# Altium project WiWi_SDR.PrjPcb (part 2 of 2)

## Sheet 14-100M_Ethernet.SchDoc
size B; SheetNumber: 14; SheetTotal: 16
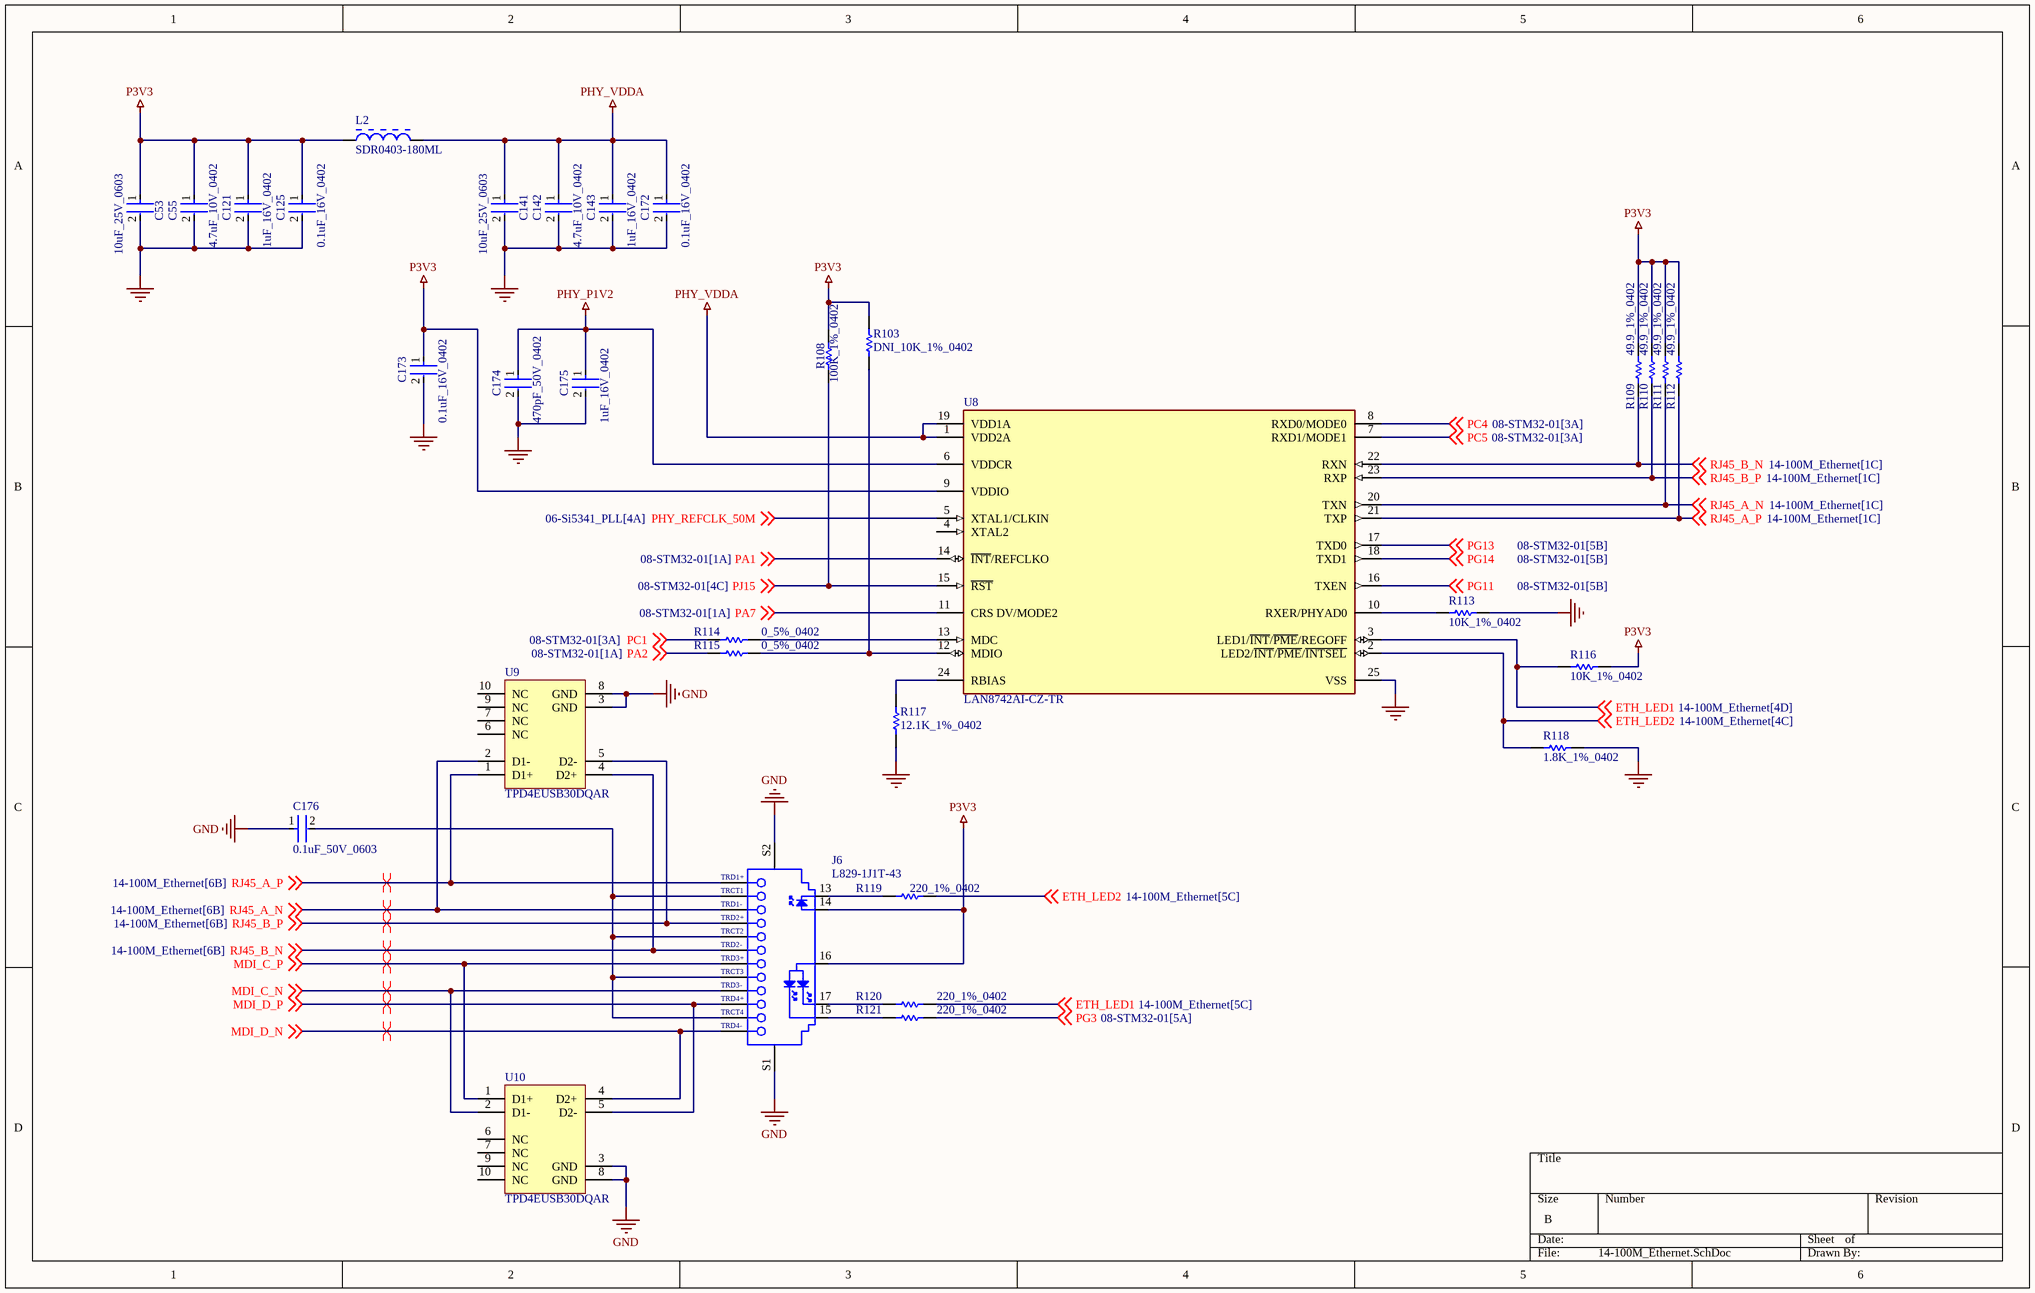
[diagram p4: 14-100M_Ethernet.SchDoc]

### Parts
C53  10uF_25V_0603  [FP-CL10-IPC_C]
C55  4.7uF_10V_0402  [FP-C1005-050-0_15-MFG]
C121  1uF_16V_0402  [FP-0402-L_1_0_0_05-W_0_5-IPC_A]
C125  0.1uF_16V_0402  [FP-C0402-BB-MFG]
C141  10uF_25V_0603  [FP-CL10-IPC_C]
C142  4.7uF_10V_0402  [FP-C1005-050-0_15-MFG]
C143  1uF_16V_0402  [FP-0402-L_1_0_0_05-W_0_5-IPC_A]
C172  0.1uF_16V_0402  [FP-C0402-BB-MFG]
C173  0.1uF_16V_0402  [FP-C0402-BB-MFG]
C174  470pF_50V_0402  [FP-GRM155-0_05-IPC_A]
C175  1uF_16V_0402  [FP-0402-L_1_0_0_05-W_0_5-IPC_A]
C176  0.1uF_50V_0603  [FP-C0603-CJ-MFG]
J6  L829-1J1T-43  [BELS-L829-1J1T-43_V]
L2  SDR0403-180ML  [BOUR-SDR0403-2_V]
R103  DNI_10K_1%_0402  [RESC1005X40X25NL10T10]  (no BOM)
R108  100K_1%_0402  [RESC1005X40X25ML05T10]
R109  49.9_1%_0402  [RESC1005X40X25NL10T10]
R110  49.9_1%_0402  [RESC1005X40X25NL10T10]
R111  49.9_1%_0402  [RESC1005X40X25NL10T10]
R112  49.9_1%_0402  [RESC1005X40X25NL10T10]
R113  10K_1%_0402  [RESC1005X40X25NL10T10]
R114  0_5%_0402  [RESC1005X40X25NL05T10]
R115  0_5%_0402  [RESC1005X40X25NL05T10]
R116  10K_1%_0402  [RESC1005X40X25NL10T10]
R117  12.1K_1%_0402  [RESC1005X40X25ML05T10]
R118  1.8K_1%_0402  [RESC1005X40X25LL05T05]
R119  220_1%_0402  [RESC1005X40X25LL10T10]
R120  220_1%_0402  [RESC1005X40X25LL10T10]
R121  220_1%_0402  [RESC1005X40X25LL10T10]
U8  LAN8742AI-CZ-TR  [FP-C04-143-MFG]
U9  TPD4EUSB30DQAR  [DQA0010A_V]
U10  TPD4EUSB30DQAR  [DQA0010A_V]

### Nets
GND: C53.2 C55.2 C121.2 C125.2 C141.2 C142.2 C143.2 C172.2 C173.2 C174.2 C175.2 C176.1 J6.S1 J6.S2 R113.1 R117.1 R118.2 U8.25(VSS) U9.3(GND) U9.8(GND) U10.3(GND) U10.8(GND)
P3V3: C53.1 C55.1 C121.1 C125.1 C173.1 J6.14 J6.16 L2.1 R103.1 R108.2 R109.1 R110.1 R111.1 R112.1 R116.1 U8.9(VDDIO)
PHY_P1V2: C174.1 C175.1 U8.6(VDDCR)
PHY_VDDA: C141.1 C142.1 C143.1 C172.1 L2.2 U8.1(VDD2A) U8.19(VDD1A)
ETH_LED1: R116.2 R120.2 U8.3(LED1/~{INT}/~{PME}/REGOFF) ; off-sheet ETH_LED1
ETH_LED2: R118.1 R119.2 U8.2(LED2/~{INT}/~{PME}/~{INTSEL}) ; off-sheet ETH_LED2
MDI_C_N: J6.9(TRD3-) U10.2(D1-) ; off-sheet MDI_C_N
MDI_C_P: J6.7(TRD3+) U10.1(D1+) ; off-sheet MDI_C_P
MDI_D_N: J6.12(TRD4-) U10.4(D2+) ; off-sheet MDI_D_N
MDI_D_P: J6.10(TRD4+) U10.5(D2-) ; off-sheet MDI_D_P
PA1: U8.14(~{INT}/REFCLKO) ; off-sheet PA1
PA2: R115.1 ; off-sheet PA2
PA7: U8.11(CRS_DV/MODE2) ; off-sheet PA7
PC1: R114.1 ; off-sheet PC1
PC4: U8.8(RXD0/MODE0) ; off-sheet PC4
PC5: U8.7(RXD1/MODE1) ; off-sheet PC5
PG3: R121.2 ; off-sheet PG3
PG11: U8.16(TXEN) ; off-sheet PG11
PG13: U8.17(TXD0) ; off-sheet PG13
PG14: U8.18(TXD1) ; off-sheet PG14
PHY_REFCLK_50M: U8.5(XTAL1/CLKIN) ; off-sheet PHY_REFCLK_50M
PJ15: R108.1 U8.15(~{RST}) ; off-sheet PJ15
RJ45_A_N: J6.3(TRD1-) R111.2 U8.20(TXN) U9.2(D1-) ; off-sheet RJ45_A_N
RJ45_A_P: J6.1(TRD1+) R112.2 U8.21(TXP) U9.1(D1+) ; off-sheet RJ45_A_P
RJ45_B_N: J6.6(TRD2-) R109.2 U8.22(RXN) U9.4(D2+) ; off-sheet RJ45_B_N
RJ45_B_P: J6.4(TRD2+) R110.2 U8.23(RXP) U9.5(D2-) ; off-sheet RJ45_B_P
NetC176_2: C176.2 J6.2(TRCT1) J6.5(TRCT2) J6.8(TRCT3) J6.11(TRCT4)
NetJ6_13: J6.13 R119.1
NetJ6_15: J6.15 R121.1
NetJ6_17: J6.17 R120.1
NetR103_2: R103.2 R115.2 U8.12(MDIO)
NetR113_2: R113.2 U8.10(RXER/PHYAD0)
NetR114_2: R114.2 U8.13(MDC)
NetR117_2: R117.2 U8.24(RBIAS)

Not connected (* = marked no-connect by the designer): U8 4(XTAL2); U9 6(NC) 7(NC) 9(NC) 10(NC); U10 6(NC) 7(NC) 9(NC) 10(NC)

### Layout directives
differential pair: MDI_C_N, MDI_C_P, MDI_D_N, MDI_D_P, RJ45_A_N, RJ45_A_P, RJ45_B_N, RJ45_B_P

### Library data of the parts
C53 C141 = CMP-13271-004224-1: Cap Ceramic 10uF 25V X5R ±20% Pad SMD 0603 +85°C T/R; Width: 0.031inch; Voltage Rating: 25V; Length: 0.063inch; Case Code (Metric): 1608; Dielectric: X5R; Termination: Wraparound; Capacitance: 10uF; Lead Free: Lead Free; Mount: Surface Mount; Package Quantity: 1; Case Code (Imperial): 0603; Thickness: 0.035inch; Packaging: Tape and Reel; Contact Plating: Tin; Min Operating Temperature: -55°C; Tolerance: 20%; Max Operating Temperature: 85°C; Case/Package: 0603
C55 C142 = CMP-2000-05997-2: CAP CER 4.7UF 10V X5R 0402; Dielectric Material: Ceramic; Tolerance: 10%; Series: C; Package Quantity: 10000; Max Operating Temperature: 85°C; Case Code (Imperial): 0402; Lead Free: Lead Free; Voltage Rating (DC): 10V; Packaging: Cut Tape; Voltage Rating: 10V; Min Operating Temperature: -55°C; Dielectric: X5R; Thickness: 0.022inch; Width: 0.02inch; Case/Package: 0402; Case Code (Metric): 1005; Capacitance: 4.7uF; Length: 0.039inch; RoHS Compliant: Yes; REACH SVHC: No SVHC; Mount: Surface Mount
C121 C143 C175 = CMP-14477-000104-2: None; Tolerance: 10%; Voltage Rating: 16V; Dielectric: X5R; Capacitance: 1uF; Packaging: Tape and Reel; Depth: 0.5mm; Mount: Surface Mount; Thickness: 0.022inch; Package Quantity: 1; Min Operating Temperature: -55°C; Series: M; Voltage Rating (DC): 16V; Termination: SMD/SMT; Case/Package: 0402; Number of Pins: 2; Case Code (Imperial): 0402; Length: 1mm; Halogen Free: Halogen Free; Case Code (Metric): 1005; Width: 0.02inch; RoHS Compliant: Yes; Radiation Hardening: No; Max Operating Temperature: 85°C; Height: 0.5mm; Construction: Flat
C125 C172 C173 = CMP-1034-02068-3: CAP CER 0.1UF 16V 5% X7R 0402; Manufacturer: Kemet; Manufacturer Part Number: C0402C104J4RACTU; Value: 0.10 μF; Temperature Coefficient: 15%; Tolerance: 0.05; Material: Ceramic; ComponentLink2URL: https://content.kemet.com/datasheets/KEM_C1002_X7R_SMD.pdf; Automotive: No; Device Class L2: Capacitors; Temperature: -55°C to +125°C; RoHS: TRUE; Voltage Rating: 16 V; ComponentLink2Description: Datasheet; Device Class L3: Ceramic Capacitors; Temperature Range Low: -55°C; Ipc Land Pattern Name: CAPC10050X50; Device Class L1: Passive Components; Temperature Range High: +125°C; Package: C0402-BB; Capacitance: 0.10 μF; Category: Cap; Mouser Description: CAP CER 0.1UF 16V X7R 0402; Height: 0.55mm; Digikey Description: CAP CER 0.1UF 16V 5% X7R 0402; Octopart: https://octopart.com/c0402c104j4ractu-kemet-12573893; Temperature Characteristic: X7R; Lead Free: Yes
C174 = CMP-2008-04369-2: Chip Multilayer Ceramic Capacitors for General Purpose, 0402, 470pF, C0G, 30ppm/°C, 5%, 50V; Insulation Resistance: 10GR; Depth: 0.5mm; Voltage Rating: 50V; Packaging: Tape and Reel; Material: Ceramic; Lead Free: Lead Free; Max Operating Temperature: 125°C; Length: 1mm; Min Operating Temperature: -55°C; Height: 0.5mm; Width: 0.5mm; Thickness: 0.022inch; Voltage: 50V; Termination: SMD/SMT; Dielectric Material: Ceramic; REACH SVHC: No SVHC; Voltage Rating (DC): 50V; Package Quantity: 1; Dielectric: C0G; Radiation Hardening: No; Mount: Surface Mount; Case/Package: 0402; Number of Pins: 2; Tolerance: 5%; Temperature Coefficient: 30ppm/°C; Case Code (Metric): 1005; Capacitance: 470pF; Case Code (Imperial): 0402
C176 = CMP-2006-03300-2: CAP CER 0.1UF 50V X7R 0603; Manufacturer Part Number: C0603X104K5RACTU; Manufacturer: Kemet; Capacitance: 100nF; Material: Ceramic; Tolerance: 10%; Value: 100nF; Temperature Coefficient: 15%; Temperature Range High: +125°C; Temperature Range Low: -55°C; Voltage: 50V; ComponentLink2Description: Datasheet; RoHS: TRUE; ComponentLink2URL: https://content.kemet.com/datasheets/KEM_C1013_X7R_FT-CAP_SMD.pdf; Device Class L3: Ceramic Capacitors; Device Class L2: Capacitors; Package: C0603-CJ; Height: 0.95mm; Device Class L1: Passive Components; Temperature Characteristic: X7R; Lead Free: Yes; Digikey Description: CAP CER 0.1UF 50V X7R 0603; Automotive: No; Mouser Description: Capacitor; Ceramic; Cap 0.1uF; Tol+10%; SMT; Flexible Termination; Vol-Rtg 50V; TR; Temperature: -55°C to +125°C; Octopart: https://octopart.com/c0603x104k5ractu-kemet-9145062; Category: Cap; Voltage Rating: 50V; Ipc Land Pattern Name: CAPC16080X80
J6 = CMP-1715-00001-1: Gigabit MagJack(R) Ultra Low Profile, 10/100/1000 Base-T, 19-Pin THD, RoHS, Tray; Width: 24.13 mm; RoHSCompliant: True; PartNumber: L829-1J1T-43; Case/Package: Metal; Mount: Through Hole; ComponentLink1Description: Manufacturer URL; Height: 11.3 mm; Package Quantity: 60; Packaging: Tray; Length: 17.78 mm; PackageDescription: 19-Pin Through Hole Device, Body 23.94 x 17.58 mm, Pitch 2.03 mm; ComponentLink2URL: http://belfuse.com/pdfs/L829-1J1T-43.pdf; ComponentLink1URL: http://belfuse.com/ethernet/; Mounting Technology: Through Hole; DatasheetVersion: Rev. G; Pins: 8; ComponentLink2Description: Datasheet
L2 = CMP-0904-00005-1: SDR0403 Series Power Inductor, 18 uF +/- 20 %, 0.34 Ohm, -40 to 125 degC, 2-Pin SMD, RoHS, Tape and Reel; Manufacturer: Bourns; Tolerance (%): +/- 20; I rms (A): 0.84 Max.; Q: 25; I sat (A): 1.3 Typ.; Test Frequency (MHz): 2.52; Inductance (uH): 18; SRF (MHz): 23 Min.; RDC (Ohm): 0.34 Max.; PackageReference: SDR0403-2; ComponentLink1URL: http://www.bourns.com/; RoHS: TRUE; PartNumber: SDR0403-180ML; ComponentLink2Description: Datasheet; Packing: Tape and Reel; Temperature Range: -40 to 125 degC; Mounting Technology: Surface Mount; DatasheetVersion: Feb-12; PackageDescription: 3-Pin SMD, Dia 4.5 mm, Height 3.5 mm; ComponentLink2URL: http://www.bourns.com/data/global/pdfs/sdr0403.pdf; ComponentLink1Description: Manufacturer URL
R103 R113 R116 = CMP-2002-04694-1: Manufacturer: Bourns; Part Number: CR0402-FX-1002GLF
R108 = CMP-2002-07852-1: Manufacturer: Yageo; Part Number: RC0402FR-13100KL
R109-R112 = CMP-2002-04448-1: Part Number: RK73H1ETTP49R9F; Manufacturer: KOA Speer
R114 R115 = CMP-2002-06457-1: Manufacturer: Panasonic; Part Number: ERJ-U020R00X
R117 = CMP-2002-07375-1: Part Number: RC0402FR-0712K1L; Manufacturer: Yageo / Phycomp
R118 = CMP-2002-01128-1: Manufacturer: Panasonic; Part Number: ERJ2RKF1801X
R119-R121 = CMP-2002-03891-1: Part Number: RK73H1ETTP2200F; Manufacturer: KOA Speer
U8 = CMP-06281-000002-1: IC TRANSCEIVER FULL 1/1 24SQFN; Manufacturer: Microchip; Simplex Duplex: Full Duplex; Max Supply Voltage: 3.6V; Standoff Height: 0mm; Number Of Channels: 1; Data Rate: 100Mbits/s; Interface: Ethernet,Other; Min Supply Voltage: 1.14V; Ambient Temperature Range Low: -40°C; Height: 1mm; Digikey Description: IC TRANSCEIVER FULL 1/1 24SQFN; Lead Free: Yes; Category: IC; Temperature Range Low: -40°C; Temperature: -40°C to +85°C; RoHS: TRUE; ComponentLink2URL: http://ww1.microchip.com/downloads/en/DeviceDoc/DS_LAN8742_00001989A.pdf; Package: C04-143; Mouser Description: Small Footprint RMII 10/100 Ethernet Transceiver with flexPWR Technology; Device Class L1: Integrated Circuits (ICs); Temperature Range High: +85°C; Device Class L2: Interface ICs; ComponentLink2Description: Datasheet; Manufacturer Part Number: LAN8742AI-CZ-TR; Device Class L3: Ethernet Interface ICs; Ambient Temperature Range High: +85°C; Ipc Land Pattern Name: QFN50P400X400X90-24; Octopart: https://octopart.com/lan8742ai-cz-tr-microchip-29030589; Automotive: No
U9 U10 = CMP-0326-00027-3: ESD Solution for Super-Speed (6 GBPS) USB 3.0 Interface, 4 Channels, -40 to +85 degC, 10-pin SON (DQA), Green (RoHS & no Sb/Br); Manufacturer: Texas Instruments; Differential Capacitance(pF): 0.05; Serial ATA / eSATA: TRUE; IO Capacitance(Typ)(pF): 0.8; IO Leakage Current(nA): 10; IEC 61000-4-2 Air-Gap(+/- kV): 8; ComponentLink3Description: URL Link1; PartNumber: TPD4EUSB30DQAR; DatasheetVersion: SLVSAC2C; ComponentLink2URL: http://www.ti.com/general/docs/lit/getliterature.tsp?genericPartNumber=TPD4EUSB30&fileType=pdf; USB Super Speed: TRUE; Eco-Plan: Green (RoHS & no Sb/Br); Mounting Technology: Surface Mount; 1394 / Firewire: TRUE; PackageVersion: revB, Sep-2009; SubFamily: ESD Solution; USB Full Speed: TRUE; USB High Speed: TRUE; ComponentLink2Description: Datasheet; ComponentLink1URL: http://www.ti.com/; IEC 61000-4-2 Contact(+/- kV): 8; Breakdown Voltage(Min)(V): 8; PackageReference: DQA0010A; ComponentLink1Description: Manufacturer URL; PackageDescription: 10-Pin Plastic Small Outline No-Lead, 1 x 2.5 x 0.55 mm Body, 0.5 mm Pitch; ComponentLink3URL: SamplesURL:http://www.ti.com/product/tpd4eusb30#samples; HDMI: TRUE

## Sheet 15-SDRAM_Flash.SchDoc
size B; SheetNumber: 15; SheetTotal: 16
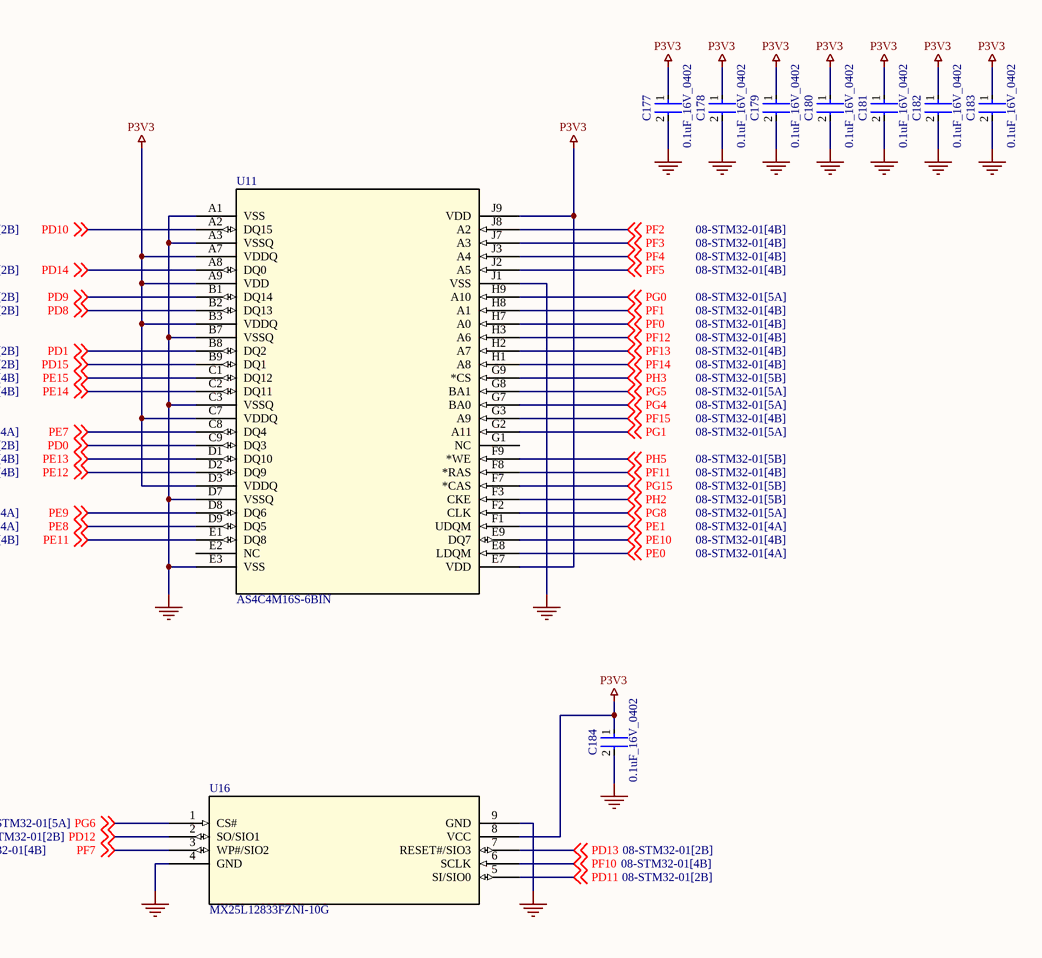
[diagram p5: 15-SDRAM_Flash.SchDoc]

### Parts
C177  0.1uF_16V_0402  [FP-C0402-BB-MFG]
C178  0.1uF_16V_0402  [FP-C0402-BB-MFG]
C179  0.1uF_16V_0402  [FP-C0402-BB-MFG]
C180  0.1uF_16V_0402  [FP-C0402-BB-MFG]
C181  0.1uF_16V_0402  [FP-C0402-BB-MFG]
C182  0.1uF_16V_0402  [FP-C0402-BB-MFG]
C183  0.1uF_16V_0402  [FP-C0402-BB-MFG]
C184  0.1uF_16V_0402  [FP-C0402-BB-MFG]
U11  AS4C4M16S-6BIN  [TFBGA-54_8X8_ALL]
U16  MX25L12833FZNI-10G  [WSON8_6X5X0p8_MAC]

### Nets
GND: C177.2 C178.2 C179.2 C180.2 C181.2 C182.2 C183.2 C184.2 U11.A1(VSS) U11.A3(VSSQ) U11.B7(VSSQ) U11.C3(VSSQ) U11.D7(VSSQ) U11.E3(VSS) U11.J1(VSS) U16.4(GND) U16.9(GND)
P3V3: C177.1 C178.1 C179.1 C180.1 C181.1 C182.1 C183.1 C184.1 U11.A7(VDDQ) U11.A9(VDD) U11.B3(VDDQ) U11.C7(VDDQ) U11.D3(VDDQ) U11.E7(VDD) U11.J9(VDD) U16.8(VCC)
PD0: U11.C9(DQ3) ; off-sheet PD0
PD1: U11.B8(DQ2) ; off-sheet PD1
PD8: U11.B2(DQ13) ; off-sheet PD8
PD9: U11.B1(DQ14) ; off-sheet PD9
PD10: U11.A2(DQ15) ; off-sheet PD10
PD11: U16.5(SI/SIO0) ; off-sheet PD11
PD12: U16.2(SO/SIO1) ; off-sheet PD12
PD13: U16.7(RESET#/SIO3) ; off-sheet PD13
PD14: U11.A8(DQ0) ; off-sheet PD14
PD15: U11.B9(DQ1) ; off-sheet PD15
PE0: U11.E8(LDQM) ; off-sheet PE0
PE1: U11.F1(UDQM) ; off-sheet PE1
PE7: U11.C8(DQ4) ; off-sheet PE7
PE8: U11.D9(DQ5) ; off-sheet PE8
PE9: U11.D8(DQ6) ; off-sheet PE9
PE10: U11.E9(DQ7) ; off-sheet PE10
PE11: U11.E1(DQ8) ; off-sheet PE11
PE12: U11.D2(DQ9) ; off-sheet PE12
PE13: U11.D1(DQ10) ; off-sheet PE13
PE14: U11.C2(DQ11) ; off-sheet PE14
PE15: U11.C1(DQ12) ; off-sheet PE15
PF0: U11.H7(A0) ; off-sheet PF0
PF1: U11.H8(A1) ; off-sheet PF1
PF2: U11.J8(A2) ; off-sheet PF2
PF3: U11.J7(A3) ; off-sheet PF3
PF4: U11.J3(A4) ; off-sheet PF4
PF5: U11.J2(A5) ; off-sheet PF5
PF7: U16.3(WP#/SIO2) ; off-sheet PF7
PF10: U16.6(SCLK) ; off-sheet PF10
PF11: U11.F8(*RAS) ; off-sheet PF11
PF12: U11.H3(A6) ; off-sheet PF12
PF13: U11.H2(A7) ; off-sheet PF13
PF14: U11.H1(A8) ; off-sheet PF14
PF15: U11.G3(A9) ; off-sheet PF15
PG0: U11.H9(A10) ; off-sheet PG0
PG1: U11.G2(A11) ; off-sheet PG1
PG4: U11.G7(BA0) ; off-sheet PG4
PG5: U11.G8(BA1) ; off-sheet PG5
PG6: U16.1(CS#) ; off-sheet PG6
PG8: U11.F2(CLK) ; off-sheet PG8
PG15: U11.F7(*CAS) ; off-sheet PG15
PH2: U11.F3(CKE) ; off-sheet PH2
PH3: U11.G9(*CS) ; off-sheet PH3
PH5: U11.F9(*WE) ; off-sheet PH5

Not connected (* = marked no-connect by the designer): U11 E2(NC) G1(NC)

### Library data of the parts
C177-C184 = CMP-1034-02068-3: as C125 on sheet 14-100M_Ethernet; ComponentLink2URL: https://content.kemet.com/datasheets/KEM_C1002_X7R_SMD.pdf; Automotive: No; Device Class L2: Capacitors; Temperature: -55°C to +125°C; RoHS: TRUE; Voltage Rating: 16 V; ComponentLink2Description: Datasheet; Device Class L3: Ceramic Capacitors; Temperature Range Low: -55°C; Ipc Land Pattern Name: CAPC10050X50; Device Class L1: Passive Components; Temperature Range High: +125°C; Package: C0402-BB; Capacitance: 0.10 μF; Category: Cap; Mouser Description: CAP CER 0.1UF 16V X7R 0402; Height: 0.55mm; Digikey Description: CAP CER 0.1UF 16V 5% X7R 0402; Octopart: https://octopart.com/c0402c104j4ractu-kemet-12573893; Temperature Characteristic: X7R; Lead Free: Yes
U11 = AS4C4M16S-6BIN: No Description Available; Mfr_Name: Alliance Memory; Copyright: Copyright (C) 2023 Ultra Librarian. All rights reserved.; Manufacturer_Part_Number: AS4C4M16S-6BIN; RefDes: RefDes; Type: DEV
U16 = MX25L12833FZNI-10G: No Description Available; Mfr_Name: Macronix; Copyright: Copyright (C) 2023 Ultra Librarian. All rights reserved.; Manufacturer_Part_Number: MX25L12833FZNI-10G; RefDes: RefDes; Type: DEV

## Sheet 16-ESP32S3.SchDoc
size B; SheetNumber: 16; SheetTotal: 16
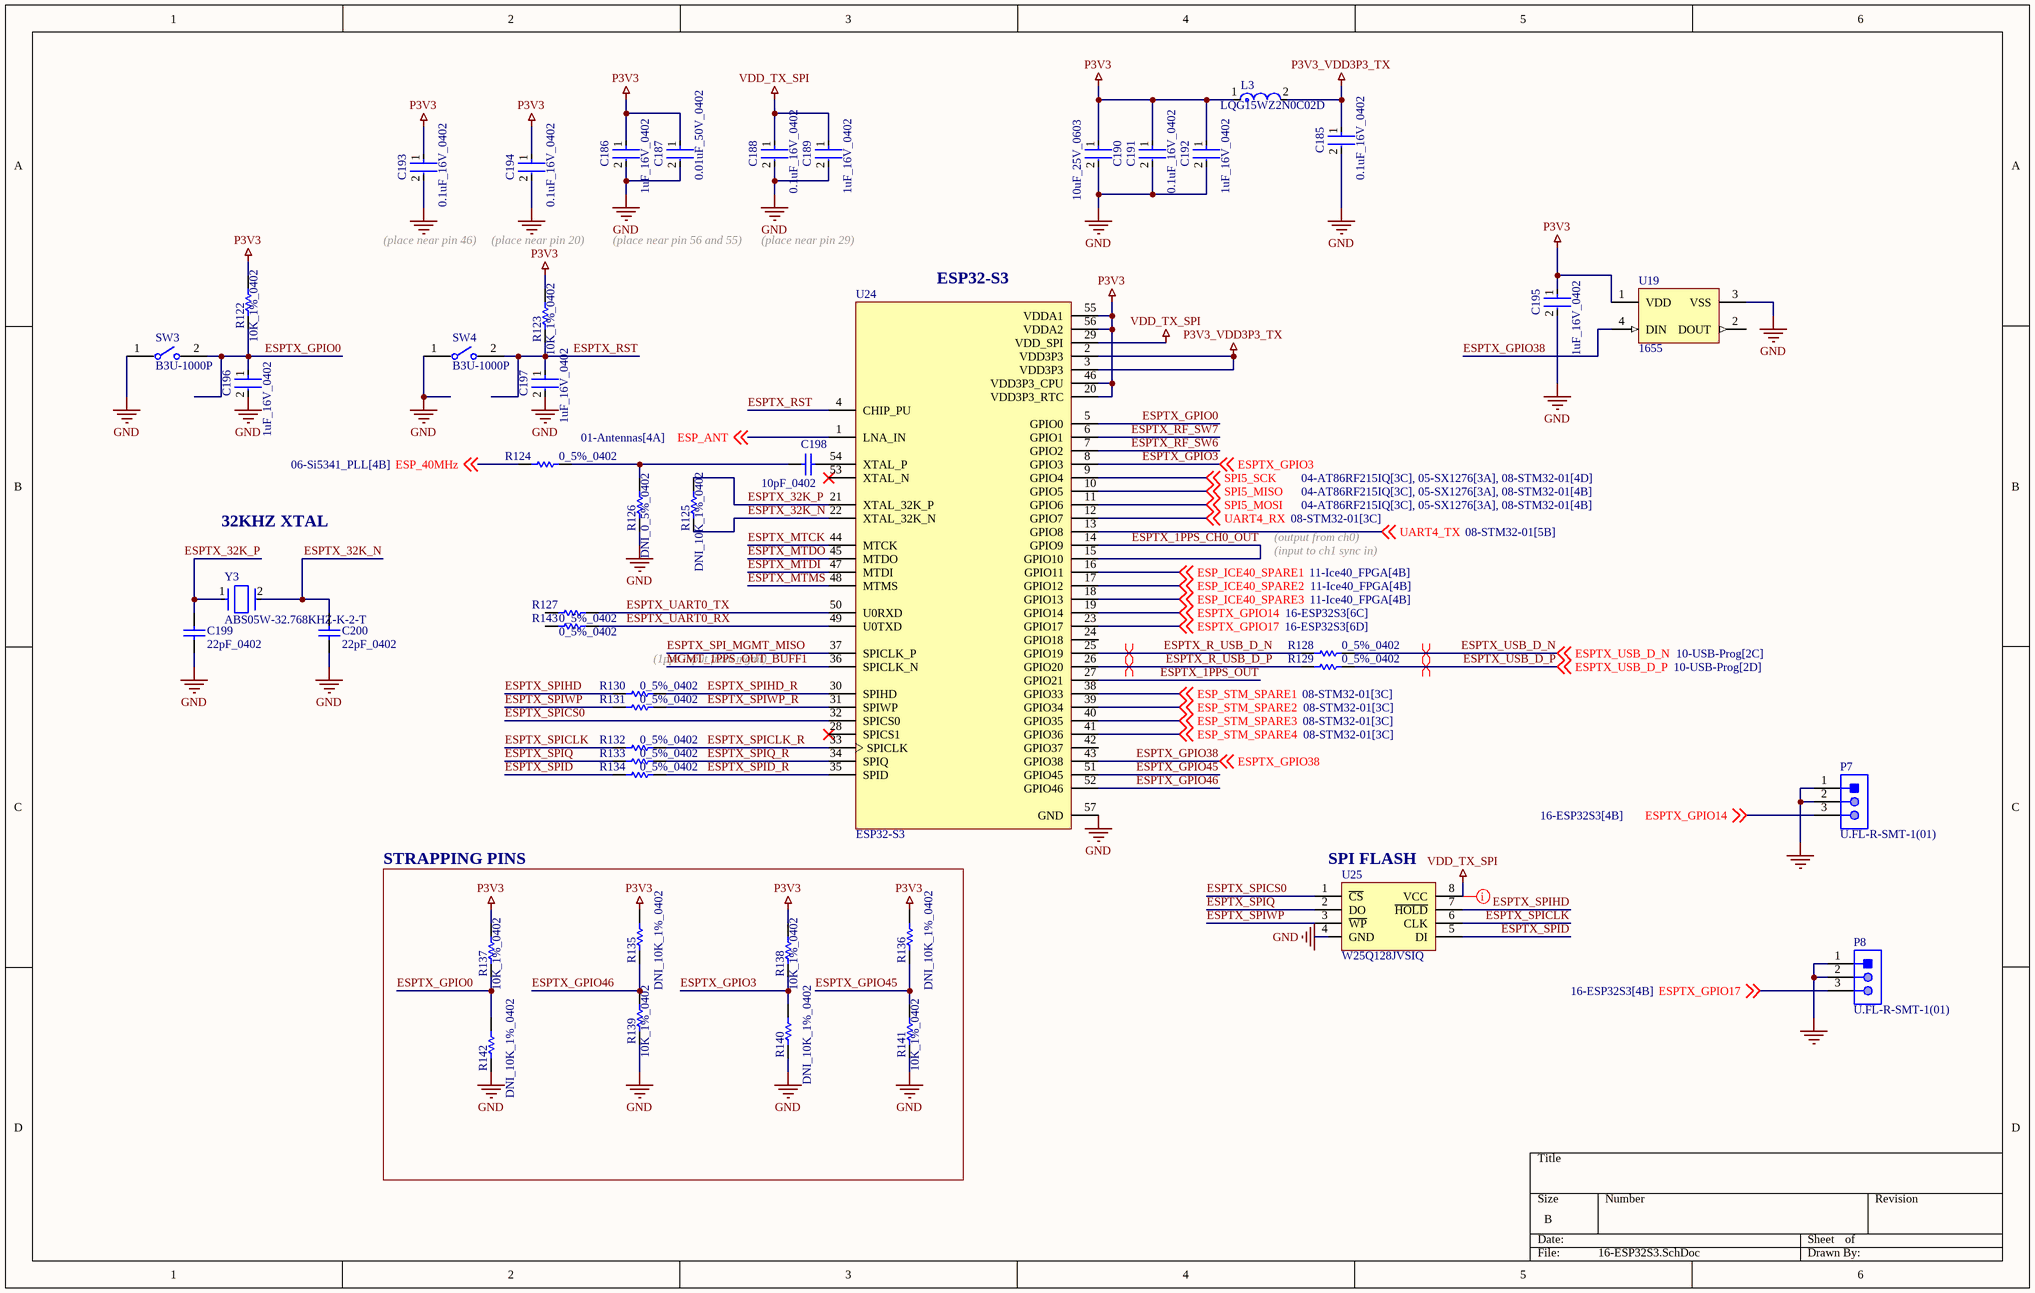
[diagram p6: 16-ESP32S3.SchDoc]

### Parts
C185  0.1uF_16V_0402  [FP-C0402-BB-MFG]
C186  1uF_16V_0402  [FP-0402-L_1_0_0_05-W_0_5-IPC_A]
C187  0.01uF_50V_0402  [FP-GCM155-0_05-IPC_C]
C188  0.1uF_16V_0402  [FP-C0402-BB-MFG]
C189  1uF_16V_0402  [FP-0402-L_1_0_0_05-W_0_5-IPC_A]
C190  10uF_25V_0603  [FP-CL10-IPC_C]
C191  0.1uF_16V_0402  [FP-C0402-BB-MFG]
C192  1uF_16V_0402  [FP-0402-L_1_0_0_05-W_0_5-IPC_A]
C193  0.1uF_16V_0402  [FP-C0402-BB-MFG]
C194  0.1uF_16V_0402  [FP-C0402-BB-MFG]
C195  1uF_16V_0402  [FP-0402-L_1_0_0_05-W_0_5-IPC_A]
C196  1uF_16V_0402  [FP-0402-L_1_0_0_05-W_0_5-IPC_A]
C197  1uF_16V_0402  [FP-0402-L_1_0_0_05-W_0_5-IPC_A]
C198  10pF_0402  [CAPC1005X55X25ML05T05]
C199  22pF_0402  [CAPC1005X55X25ML05T05]
C200  22pF_0402  [CAPC1005X55X25ML05T05]
L3  LQG15WZ2N0C02D  [FP-LQG15WH_02-IPC_B]
P7  U.FL-R-SMT-1(01)  [HRS-U.FL-R-SMT-3_V]
P8  U.FL-R-SMT-1(01)  [HRS-U.FL-R-SMT-3_V]
R122  10K_1%_0402  [RESC1005X40X25NL10T10]
R123  10K_1%_0402  [RESC1005X40X25NL10T10]
R124  0_5%_0402  [RESC1005X40X25NL05T10]
R125  DNI_10K_1%_0402  [RESC1005X40X25NL10T10]  (no BOM)
R126  DNI_0_5%_0402  [RESC1005X40X25NL05T10]  (no BOM)
R127  0_5%_0402  [RESC1005X40X25NL05T10]
R128  0_5%_0402  [RESC1005X40X25NL05T10]
R129  0_5%_0402  [RESC1005X40X25NL05T10]
R130  0_5%_0402  [RESC1005X40X25NL05T10]
R131  0_5%_0402  [RESC1005X40X25NL05T10]
R132  0_5%_0402  [RESC1005X40X25NL05T10]
R133  0_5%_0402  [RESC1005X40X25NL05T10]
R134  0_5%_0402  [RESC1005X40X25NL05T10]
R135  DNI_10K_1%_0402  [RESC1005X40X25NL10T10]  (no BOM)
R136  DNI_10K_1%_0402  [RESC1005X40X25NL10T10]  (no BOM)
R137  10K_1%_0402  [RESC1005X40X25NL10T10]
R138  10K_1%_0402  [RESC1005X40X25NL10T10]
R139  10K_1%_0402  [RESC1005X40X25NL10T10]
R140  DNI_10K_1%_0402  [RESC1005X40X25NL10T10]  (no BOM)
R141  10K_1%_0402  [RESC1005X40X25NL10T10]
R142  DNI_10K_1%_0402  [RESC1005X40X25NL10T10]  (no BOM)
R143  0_5%_0402  [RESC1005X40X25NL05T10]
SW3  B3U-1000P  [FP-B3U-1000P-MFG]
SW4  B3U-1000P  [FP-B3U-1000P-MFG]
U19  1655  [ADA-RGB-1655_V]
U24  ESP32-S3  [IC_ESP32-S3]
U25  W25Q128JVSIQ  [IC_W25Q128JVSIQ]
Y3  ABS05W-32.768KHZ-K-2-T  [FP-ABS05W-MFG]

### Blocks framed on the sheet
STRAPPING PINS: R135-R142

### Nets
GND: C185.2 C186.2 C187.2 C188.2 C189.2 C190.2 C191.2 C192.2 C193.2 C194.2 C195.2 C196.2 C197.2 C199.1 C200.1 P7.1 P7.2 P8.1 P8.2 R126.1 R139.1 R140.1 R141.1 R142.1 SW3.1 SW4.1 U19.3(VSS) U24.57(GND) U25.4(GND)
P3V3: C186.1 C187.1 C190.1 C191.1 C192.1 C193.1 C194.1 C195.1 L3.1 R122.2 R123.2 R135.2 R136.2 R137.2 R138.2 U19.1(VDD) U24.20(VDD3P3_RTC) U24.46(VDD3P3_CPU) U24.55(VDDA1) U24.56(VDDA2)
P3V3_VDD3P3_TX: C185.1 L3.2 U24.2(VDD3P3) U24.3(VDD3P3)
VDD_TX_SPI: C188.1 C189.1 U24.29(VDD_SPI) U25.8(VCC)
ESP_40MHz: R124.1 ; off-sheet ESP_40MHz
ESP_ANT: U24.1(LNA_IN) ; off-sheet ESP_ANT
ESP_ICE40_SPARE1: U24.16(GPIO11) ; off-sheet ESP_ICE40_SPARE1
ESP_ICE40_SPARE2: U24.17(GPIO12) ; off-sheet ESP_ICE40_SPARE2
ESP_ICE40_SPARE3: U24.18(GPIO13) ; off-sheet ESP_ICE40_SPARE3
ESP_STM_SPARE1: U24.38(GPIO33) ; off-sheet ESP_STM_SPARE1
ESP_STM_SPARE2: U24.39(GPIO34) ; off-sheet ESP_STM_SPARE2
ESP_STM_SPARE3: U24.40(GPIO35) ; off-sheet ESP_STM_SPARE3
ESP_STM_SPARE4: U24.41(GPIO36) ; off-sheet ESP_STM_SPARE4
ESPTX_1PPS_CH0_OUT: U24.14(GPIO9) U24.15(GPIO10)
ESPTX_1PPS_OUT: U24.27(GPIO21)
ESPTX_32K_N: C200.2 R125.1 U24.22(XTAL_32K_N) Y3.2
ESPTX_32K_P: C199.2 R125.2 U24.21(XTAL_32K_P) Y3.1
ESPTX_GPIO0: C196.1 R122.1 R137.1 R142.2 SW3.2 U24.5(GPIO0)
ESPTX_GPIO3: R138.1 R140.2 U24.8(GPIO3) ; off-sheet ESPTX_GPIO3
ESPTX_GPIO14: P7.3 U24.19(GPIO14) ; off-sheet ESPTX_GPIO14
ESPTX_GPIO17: P8.3 U24.23(GPIO17) ; off-sheet ESPTX_GPIO17
ESPTX_GPIO38: U19.4(DIN) U24.43(GPIO38) ; off-sheet ESPTX_GPIO38
ESPTX_GPIO45: R136.1 R141.2 U24.51(GPIO45)
ESPTX_GPIO46: R135.1 R139.2 U24.52(GPIO46)
ESPTX_MTCK: U24.44(MTCK)
ESPTX_MTDI: U24.47(MTDI)
ESPTX_MTDO: U24.45(MTDO)
ESPTX_MTMS: U24.48(MTMS)
ESPTX_R_USB_D_N: R128.1 U24.25(GPIO19)
ESPTX_R_USB_D_P: R129.1 U24.26(GPIO20)
ESPTX_RF_SW6: U24.7(GPIO2)
ESPTX_RF_SW7: U24.6(GPIO1)
ESPTX_RST: C197.1 R123.1 SW4.2 U24.4(CHIP_PU)
ESPTX_SPI_MGMT_MISO: U24.37(SPICLK_P)
ESPTX_SPICLK: R132.1 U25.6(CLK)
ESPTX_SPICLK_R: R132.2 U24.33(SPICLK)
ESPTX_SPICS0: U24.32(SPICS0) U25.1(~{CS})
ESPTX_SPID: R134.1 U25.5(DI)
ESPTX_SPID_R: R134.2 U24.35(SPID)
ESPTX_SPIHD: R130.1 U25.7(~{HOLD})
ESPTX_SPIHD_R: R130.2 U24.30(SPIHD)
ESPTX_SPIQ: R133.1 U25.2(DO)
ESPTX_SPIQ_R: R133.2 U24.34(SPIQ)
ESPTX_SPIWP: R131.1 U25.3(~{WP})
ESPTX_SPIWP_R: R131.2 U24.31(SPIWP)
ESPTX_UART0_RX: R143.2 U24.49(U0TXD)
ESPTX_UART0_TX: R127.2 U24.50(U0RXD)
ESPTX_USB_D_N: R128.2 ; off-sheet ESPTX_USB_D_N
ESPTX_USB_D_P: R129.2 ; off-sheet ESPTX_USB_D_P
MGMT_1PPS_OUT_BUFF1: U24.36(SPICLK_N)
SPI5_MISO: U24.10(GPIO5) ; off-sheet SPI5_MISO
SPI5_MOSI: U24.11(GPIO6) ; off-sheet SPI5_MOSI
SPI5_SCK: U24.9(GPIO4) ; off-sheet SPI5_SCK
UART4_RX: U24.12(GPIO7) ; off-sheet UART4_RX
UART4_TX: U24.13(GPIO8) ; off-sheet UART4_TX
NetC198_1: C198.1 R124.2 R126.2
NetC198_2: C198.2 U24.54(XTAL_P)

Not connected (* = marked no-connect by the designer): R127 1; R143 1; U19 2(DOUT); U24 24(GPIO18) 28(SPICS1)* 42(GPIO37) 53(XTAL_N)*

### Layout directives
differential pair: ESPTX_R_USB_D_N, ESPTX_R_USB_D_P, ESPTX_USB_D_N, ESPTX_USB_D_P
net class Power: VDD_TX_SPI

### Notes on the sheet
- (place near pin 46)
- (place near pin 20)
- (place near pin 56 and 55)
- (place near pin 29)
- (near U24) ESP32-S3
- 32KHZ XTAL
- (input to ch1 sync in)
- (output from ch0)
- (1pps input from mgmt)
- (near U25) SPI FLASH

### Library data of the parts
C185 C188 C191 C193 C194 = CMP-1034-02068-3: as C125 on sheet 14-100M_Ethernet; ComponentLink2URL: https://content.kemet.com/datasheets/KEM_C1002_X7R_SMD.pdf; Automotive: No; Device Class L2: Capacitors; Temperature: -55°C to +125°C; RoHS: TRUE; Voltage Rating: 16 V; ComponentLink2Description: Datasheet; Device Class L3: Ceramic Capacitors; Temperature Range Low: -55°C; Ipc Land Pattern Name: CAPC10050X50; Device Class L1: Passive Components; Temperature Range High: +125°C; Package: C0402-BB; Capacitance: 0.10 μF; Category: Cap; Mouser Description: CAP CER 0.1UF 16V X7R 0402; Height: 0.55mm; Digikey Description: CAP CER 0.1UF 16V 5% X7R 0402; Octopart: https://octopart.com/c0402c104j4ractu-kemet-12573893; Temperature Characteristic: X7R; Lead Free: Yes
C186 C189 C192 C195-C197 = CMP-14477-000104-2: as C121 on sheet 14-100M_Ethernet; Packaging: Tape and Reel; Depth: 0.5mm; Mount: Surface Mount; Thickness: 0.022inch; Package Quantity: 1; Min Operating Temperature: -55°C; Series: M; Voltage Rating (DC): 16V; Termination: SMD/SMT; Case/Package: 0402; Number of Pins: 2; Case Code (Imperial): 0402; Length: 1mm; Halogen Free: Halogen Free; Case Code (Metric): 1005; Width: 0.02inch; RoHS Compliant: Yes; Radiation Hardening: No; Max Operating Temperature: 85°C; Height: 0.5mm; Construction: Flat
C187 = CMP-2008-03723-3: Ceramic Capacitor for Automotive 10nF ±10% 50VDC X7R 0402 Paper T/R; Voltage Rating (DC): 50V; Min Operating Temperature: -55°C; Radiation Hardening: No; Mount: Surface Mount; Thickness: 0.022inch; Package Quantity: 1; Case Code (Imperial): 0402; Lead Free: Lead Free; Case/Package: 0402; Depth: 0.5mm; Termination: SMD/SMT; Tolerance: 10%; Voltage: 50V; Packaging: Tape and Reel; Width: 0.02inch; REACH SVHC: No SVHC; Height: 0.5mm; Max Operating Temperature: 125°C; Case Code (Metric): 1005; Voltage Rating: 50V; Capacitance: 10nF; Ratings: AEC-Q200; Length: 1mm; Dielectric: X7R
C190 = CMP-13271-004224-1: as C53 on sheet 14-100M_Ethernet; Width: 0.031inch; Voltage Rating: 25V; Length: 0.063inch; Case Code (Metric): 1608; Dielectric: X5R; Termination: Wraparound; Capacitance: 10uF; Lead Free: Lead Free; Mount: Surface Mount; Package Quantity: 1; Case Code (Imperial): 0603; Thickness: 0.035inch; Packaging: Tape and Reel; Contact Plating: Tin; Min Operating Temperature: -55°C; Tolerance: 20%; Max Operating Temperature: 85°C; Case/Package: 0603
C198 = CMP-2100-03589-1: Chip Capacitor, 10 pF, +/- 5%, 50 V, -55 to 125 degC, 0402 (1005 Metric), RoHS, Tape and Reel; Manufacturer: Yageo; Insulation Resistance: 100GR; Voltage Rating (DC): 50V; Dielectric Material: Ceramic; Temperature Coefficient: 30ppm/degC; Dielectric: C0G; Capacitance: 10pF; Termination: SMD/SMT; Package Reference: 0402; Lead Free: LeadFree; Composition: Ceramic; Tolerance: 5%; Case Code (Metric): 1005; Voltage Rating: 50V; Packaging: TapeandReel; Manufacturer URL: http://www.yageo.com/; REACH SVHC: NoSVHC; Max Operating Temperature: 125degC; Length: 1mm; Mount: SurfaceMount; Depth: 0.5mm; Min Operating Temperature: -55degC; Number of Pins: 2; Width: 0.02inch; Datasheet Version: Rev. 14, 07/2016; Package Quantity: 1; Datasheet URL: http://www.yageo.com/documents/recent/UPY-GP_NP0_16V-to-50V_14.pdf; Case Code (Imperial): 0402; RoHSCompliant: True; Radiation Hardening: No; Height: 0.5mm; Case/Package: 0402; Thickness: 0.022inch; Package Description: 2-Pin Surface Mount Device, Body 1 x 0.5 mm; Voltage: 50V
C199 C200 = CMP-2100-03590-1: Chip Capacitor, 22 pF, +/- 5%, 50 V, -55 to 125 degC, 0402 (1005 Metric), RoHS, Tape and Reel; Manufacturer: Yageo; Voltage Rating: 50V; Dielectric Material: Ceramic; Capacitance: 22pF; Temperature Coefficient: 30ppm/degC; Dielectric: C0G; Insulation Resistance: 100GR; Datasheet URL: http://www.yageo.com/NewPortal/yageodocoutput?fileName=/pdf/MLCC/UPY-GP_NP0_16V-to-50V_14.pdf; Depth: 0.5mm; Number of Pins: 2; Height: 0.5mm; Min Operating Temperature: -55degC; REACH SVHC: NoSVHC; Max Operating Temperature: 125degC; Voltage Rating (DC): 50V; Composition: Ceramic; Packaging: TapeandReel; Package Quantity: 1; Package Reference: 0402; Length: 1mm; Radiation Hardening: No; Package Description: 2-Pin Surface Mount Device, Body 1 x 0.5 mm; RoHSCompliant: True; Thickness: 0.022inch; Manufacturer URL: http://www.yageo.com/; Mount: SurfaceMount; Case Code (Metric): 1005; Case/Package: 0402; Tolerance: 5%; Termination: SMD/SMT; Width: 0.02inch; Datasheet Version: Rev. 14, 07/2016; Lead Free: LeadFree; Case Code (Imperial): 0402
L3 = CMP-06042-012509-1: Multilayer type Inductor for Automotive 2nH ±0.2nH 0.05Ω 1000mA 0402; Test Frequency: 100MHz; Shielding: Unshielded; DC Resistance (DCR): 50mR; Self Resonant Frequency: 8GHz; Current Rating: 1A; Core Material: Air; Case Code (Metric): 1005; Case/Package: 0402; Mount: Surface Mount; Min Operating Temperature: -55°C; Inductance: 2nH; Ratings: AEC-Q200; Max Operating Temperature: 125°C; Packaging: Cut Tape; Case Code (Imperial): 0402
P7 P8 = CMP-2000-05153-1: Ultra Small Coaxial Connector, 6 GHz, -40 to 90 degC, 3-Pin SMD, RoHS, Bulk; Manufacturer: Hirose Electric; Connector Style: U.FL; Impedance: 50Ohm; Dielectric Material: LiquidCrystalPolymer(LCP); Minimum Quantity: UltraMiniatureCoaxial; Online Catalog: U.FLSeries; Featured Product: HiroseU.FLSeries; Frequency - Max: 6GHz; Other Names: H122041 / U.FL-R-SMT-1(01)-ND; Contact Termination: Solder; Body Material: PhosphorBronze; Connector Type: Jack,MalePin; Body Finish: Silver; Center Contact Plating: Gold; Manufacturer URL: https://www.hirose.com; Family: CoaxialConnectors(RF); Fastening Type: Snap-On; Unit PriceUSD: U.FL; Series: U.FL; Package Reference: U.FL-R-SMT; Packaging: Bulk; Standard Package: 100; Mounting Type: SurfaceMount; Quantity Available: Bulk; Housing Color: Silver; Package Description: 3-Pin Surface Mount Device, Body 2.6 x 2.6 mm; Category: Connectors,Interconnects; Operating Temperature: -40degC~90degC; Center Contact Material: PhosphorBronze; Dynamic Catalog: U.FLSeries; Datasheet URL: https://datasheet.ciiva.com/26945/getdatasheetpartid-475239-26945414.pdf; Datasheet Version: Feb-09; Shield Termination: Solder
R122 R123 R125 R135-R142 = CMP-2002-04694-1: as R103 on sheet 14-100M_Ethernet
R124 R126-R134 R143 = CMP-2002-06457-1: as R114 on sheet 14-100M_Ethernet
SW3 SW4 = CMP-2100-03586-2: SWITCH TACTILE SPST-NO 0.05A 12V; Contact Resistance: 100mR; Operating Force: 1.5N; Max Current Rating: 50mA; Switch Travel: 0.15mm; Actuator Type: Standard; Mechanical Life: 200000Cycles; Ratings: Dust Proof; Illumination Type: Non-Illuminated; Throw Configuration: SPST; Actuator Length: 0.4mm; Switch Function: Off-Mom; Height: 1.2mm; Width: 3mm; Weight: 0.000776oz; Contact Material: Silver; Max Voltage Rating (DC): 12V; Insulation Resistance: 100MR; Lead Free: Lead Free; Current Rating: 50mA; Termination: SMD/SMT; Length: 4mm; Voltage Rating (DC): 12V; Contact Current Rating: 50mA; Orientation: Straight; Depth: 2.5mm; Max Operating Temperature: 70°C; Packaging: Tape and Reel; Min Operating Temperature: -25°C; Package Quantity: 1; Mount: Surface Mount; Electrical Life: 200000Cycles
U19 = CMP-2000-05026-1: Intelligent Control LED Integrated Light Source, 3.5 to 5.3 V, -25 to 80 degC, 4-Pin SMD, RoHS, Tape and Reel; Manufacturer: Adafruit-Industries-LLC; Number of LEDs: 10; Configuration: Discrete; Utilized LED: WS2812(5050); Datasheet URL: http://datasheet.octopart.com/ADA1655-Adafruit-Industries-datasheet-32028139.pdf; Series: Neopixel; Interface: -; Package Description: 4-Pin Surface Mount Device, Body 5 x 5 mm; Color: Red,Green,Blue(RGB); Category: Optoelectronics; Controller Type: -; Package Reference: 1655; Manufacturer URL: https://www.adafruit.com/; Mounting Type: SurfaceMount; Datasheet Version: May-13; Size / Dimension: 5.00mmLx5.00mmW; Family: Addressable,Specialty
U24 = IC_ESP32-S3: IC RF TxRx + MCU Bluetooth, WiFi 802.11b/g/n, Bluetooth v5.0 2.412GHz ~ 2.484GHz 56-VFQFN Exposed Pad; MF: Espressif Systems; Check_prices: https://www.snapeda.com/parts/ESP32-S3/Espressif+Systems/view-part/?ref=eda; Purchase-URL: https://pricing.snapeda.com/search/part/ESP32-S3/?ref=eda; Value: *; Availability: In Stock; Package: None; SnapEDA_Link: https://www.snapeda.com/parts/ESP32-S3/Espressif+Systems/view-part/?ref=snap; MP: ESP32-S3; Price: None; Supplier 1: LCSC; Supplier Part Number 1: C2913192
U25 = IC_W25Q128JVSIQ: NOR Flash Serial (SPI, Dual SPI, Quad SPI) 3.3V 128M-bit 16M x 8 6ns 8-Pin SOIC Tube; Manufacturer: Winbond; Memory Format: Non-Volatile,FLASH; Frequency: 133MHz; Memory Size: 128Mb; Supplier 1: Digi-Key; Manufacturer Part Number: W25Q128JVSIQ; RoHS: Yes; Category: Flash; Stock 1: 154352; Pricing 1: 1=1.71, 10=1.562, 25=1.52, 50=1.5124, 100=1.3519, 250=1.348, 500=1.32762, 1000=1.27127, 5000=1.18359 (USD); Mounting Technology: Surface Mount; Case/Package: SOIC; Min Operating Temperature: -40°C; Max Operating Temperature: 85°C; Packaging: Tray; Series: SpiFlash®; RoHS Compliant: Yes; ComponentLink1URL: http://www.winbond.com/resource-files/w25q128jv%20revf%2003272018%20plus.pdf?src-supplier=Digi-Key; ComponentLink1Description: http://www.winbond.com/resource-files/w25q128jv%20revf%2003272018%20plus.pdf?src-supplier=Digi-Key; Supplier Part Number 1: W25Q128JVSIQ-ND
Y3 = CMP-27762-015607-1: Crystal 32.768kHz ±20ppm (Tol) 4pF 85kΩ 2-Pin SMD T/R; ESR (Equivalent Series Resistance): 85kR; Frequency Tolerance: 20ppm; Mount: Surface Mount; Load Capacitance: 4pF; Case/Package: SMD/SMT; Packaging: Cut Tape; Frequency: 32.768kHz; Series: ABS05W; Min Operating Temperature: -40°C; Max Operating Temperature: 125°C

## Nets that join several sheets
GND: 04-AT86RF215IQ (38 pins), 10-USB-Prog (17 pins), 11-Ice40_FPGA (13 pins), 12-Power (25 pins), 14-100M_Ethernet (22 pins), 15-SDRAM_Flash (17 pins), 16-ESP32S3 (29 pins)
P1V2_FPGA: 11-Ice40_FPGA (8 pins), 12-Power (5 pins)
P3V3: 04-AT86RF215IQ (11 pins), 11-Ice40_FPGA (16 pins), 12-Power (10 pins), 14-100M_Ethernet (16 pins), 15-SDRAM_Flash (16 pins), 16-ESP32S3 (20 pins)
VBUS_USB: 10-USB-Prog (5 pins), 12-Power (Q1.3)
ESP_ICE40_SPARE1: 11-Ice40_FPGA (U15.36), 16-ESP32S3 (U24.16)
ESP_ICE40_SPARE2: 11-Ice40_FPGA (U15.43), 16-ESP32S3 (U24.17)
ESP_ICE40_SPARE3: 11-Ice40_FPGA (U15.38), 16-ESP32S3 (U24.18)
ESPTX_USB_D_N: 10-USB-Prog (U28.3), 16-ESP32S3 (R128.2)
ESPTX_USB_D_P: 10-USB-Prog (U28.4), 16-ESP32S3 (R129.2)
SDR_RX_SUBG_N: 04-AT86RF215IQ (R9.1 U1.30), 11-Ice40_FPGA (U15.12)
SDR_RX_SUBG_P: 04-AT86RF215IQ (R9.2 U1.31), 11-Ice40_FPGA (U15.11)
SDR_RX_WIFI_N: 04-AT86RF215IQ (R10.1 U1.35), 11-Ice40_FPGA (U15.3)
SDR_RX_WIFI_P: 04-AT86RF215IQ (R10.2 U1.36), 11-Ice40_FPGA (U15.2)
SDR_RXCLK_N: 04-AT86RF215IQ (R4.1 U1.34), 11-Ice40_FPGA (U15.9)
SDR_RXCLK_P: 04-AT86RF215IQ (R4.2 U1.33), 11-Ice40_FPGA (U15.10)
SDR_TX_N: 04-AT86RF215IQ (R7.1 U1.27), 11-Ice40_FPGA (U15.19)
SDR_TX_P: 04-AT86RF215IQ (R7.2 U1.28), 11-Ice40_FPGA (U15.18)
SDR_TXCLK_N: 04-AT86RF215IQ (R5.1 U1.25), 11-Ice40_FPGA (U15.21)
SDR_TXCLK_P: 04-AT86RF215IQ (R5.2 U1.26), 11-Ice40_FPGA (U15.20)
SPI5_MISO: 04-AT86RF215IQ (R14.1), 16-ESP32S3 (U24.10)
SPI5_MOSI: 04-AT86RF215IQ (R13.1), 16-ESP32S3 (U24.11)
SPI5_SCK: 04-AT86RF215IQ (R11.1), 16-ESP32S3 (U24.9)

## Assembly variants
845-XXXXX_PCBA_projectname: not fitted R6 R9 R10